# EAGLE design USB-C-UPDI (EAGLE 9.6.2)
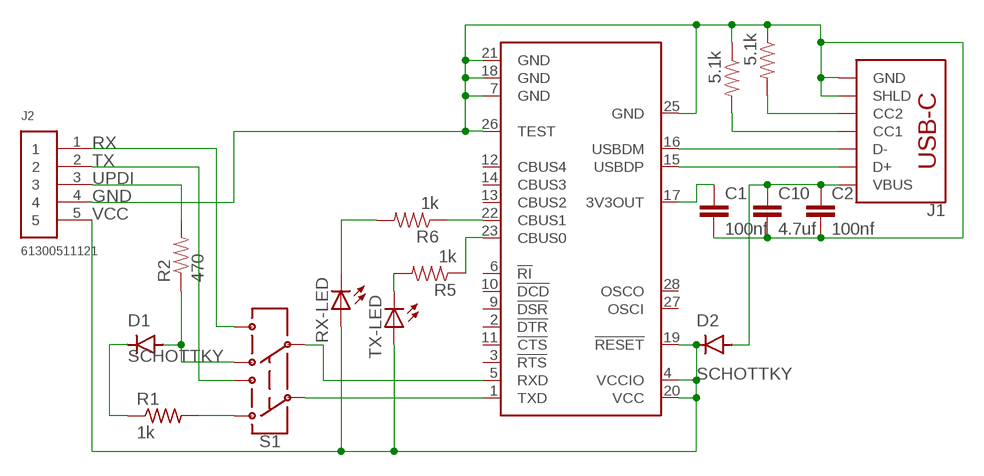
[diagram p0: schematic, sheet 1]

## Parts
C1  100nf  CAP1206  [1206]
C2  100nf  CAP1206  [1206]
C10  4.7uf  CAP1206  [1206]
D1  SCHOTTKY  DIODE_SCHOTTKY_CDBM1100-G  [MINI-SMA]
D2  SCHOTTKY  DIODE_SCHOTTKY_CDBM1100-G  [MINI-SMA]
IC1  FT232RL  [SSOP28]
J1  USB_C_4-LAYER_PADS  [USB-C-16P_4LAYER-PADS]
J2  61300511121  [61300511121]
R1  1k  R1206FAB  [R1206FAB]
R2  470  RESISTOR1206  [1206]
R5  1k  RESISTOR1206  [1206]
R6  1k  RESISTOR1206  [1206]
R9  5.1k  RESISTOR1206  [1206]
R10  5.1k  RESISTOR1206  [1206]
RX-LED  LED  [LED1206]
S1  SWITCH-DPDT-SMD-AYZ0202  [SWITCH_DPDT_SMD_AYZ0202]
TX-LED  LED  [LED1206]

## Nets
GND: C1.2 C2.2 C10.2 IC1.7(GND) IC1.18(GND) IC1.21(GND) IC1.25(GND) IC1.26(TEST) J1.GND J1.GND2(GND) J1.SHLD1(SHLD) J1.SHLD2(SHLD) J1.SHLD3(SHLD) J1.SHLD4(SHLD) J2.4 R9.1 R10.1
N$1: C1.1 IC1.17(3V3OUT)
N$2: IC1.16(USBDM) J1.A7(D-) J1.B7(D-)
N$3: D1.ANODE R2.1 S1.6
N$4: D1.KATHODE R1.1
N$5: IC1.15(USBDP) J1.A6(D+) J1.B6(D+)
N$7: IC1.5(RXD) S1.5
N$9: J1.A5(CC1) R9.2
N$10: IC1.1(TXD) S1.2
N$11: R1.2 S1.3
N$42: J1.B5(CC2) R10.2
N$43: IC1.22(CBUS1) R6.1
N$44: IC1.23(CBUS0) R5.1
N$45: R5.2 TX-LED.2(C)
N$46: R6.2 RX-LED.2(C)
N$49: C2.1 C10.1 D2.ANODE J1.VBUS1(VBUS) J1.VBUS2(VBUS)
RX: J2.1 S1.4
TX: J2.2 S1.1
UPDI: J2.3 R2.2
VCC: D2.KATHODE IC1.4(VCCIO) IC1.19(!RESET) IC1.20(VCC) J2.5 RX-LED.1(A) TX-LED.1(A)
Unconnected: IC1.2(!DTR) IC1.3(!RTS) IC1.6(!RI) IC1.9(!DSR) IC1.10(!DCD) IC1.11(!CTS) IC1.12(CBUS4) IC1.13(CBUS2) IC1.14(CBUS3) IC1.27(OSCI) IC1.28(OSCO)

## Library data of the parts
C1 C2 C10 = 01_SparkFun:CAP: Capacitor Standard 0603 ceramic capacitor, and 0.1" leaded capacitor.
D1 D2 = eagle_fab:DIODE_SCHOTTKY_CDBM1100-G: Diode schottky 100V 1A mini-SMA as found in the fablab inventory Reverse Voltage: 100 Volts Forward Current: 1.0 Amp Maximum forward voltage: 0.85 Volts Made by Zaerc.
IC1 = ftdichip:FT232R: Source: http://www.ftdichip.com/Documents/DataSheets/DS_FT232R_v104.pdf; MPN: FT232RL; OC_FARNELL: 1146032; OC_NEWARK: 91K9918
J1 = SparkFun-Connectors:USB_C: USB Type C 16Pin Connector Super Speed pins not available on the 16-pin purely SMD connector so this part is best for USB 2.0 implementations. D1 and D2 are tied together enabling D+/- no matter which way the cable is plugged into the connector. The two channel configuration pins (CC1/2) are exposed. These are normally connected to ground via 5.1k resistors but can be reconfigured for high current/high power applications. **4-LAYER BOARD WARNING!!** If designing 4-layer board, make sure to select the variant _4-LAYER-ISOLATED. The linked footprint (USB-C-16-4LAYER-ISOLATED) includes some very necessary cutout polygons in the inner layers (2 and 15). This prevents the PTH mounting shield legs on the USB connector from electrically connecting any other polygons on the inner layers (usually VCC and GND).; PROD_ID: CONN-14122
J2 = Headers:61300511121: CONN HEADER VERT 5POS 2.54MM Manufacturer's datasheet <https://katalog.we-online.de/em/datasheet/6130xx11121.pdf>; CREATED_BY: PCBLayout.com; DIGI_KEY_PART_NUMBER: 732-5318-ND; MANUFACTURER: Wurth Electronics Inc.; MPN: 61300511121
R1 = eagle_fab:R: Resistor (US Symbol) Variants with postfix FAB are widened to allow the routing of internal traces
R2 R5 R6 R9 R10 = 01_SparkFun:RESISTOR: Resistor Basic schematic elements and footprints for 0603, 1206, and PTH 1/10th watt (small) resistors.
RX-LED TX-LED = eagle_fab:LED: LED
S1 = SparkFun-Switches:SWITCH-DPDT: Double-Pole, Double-Throw (DPDT) Switch Double-pole, double-throw switches. Variant Overview PTH-GPI-152-3013 Used on SparkFun Geiger Counter <https://www.sparkfun.com/products/11345> SMD-AY0202 Surface Mount DPDT Switch <https://www.sparkfun.com/products/597> (COM-00597) Used on e.g. LilyPad Arduino USB - ATmega32U4 Board <https://www.sparkfun.com/products/12049>; PROD_ID: SWCH-08179; SF_SKU: COM-00597

## Net classes
0 default: width 0.457 mm

## Board
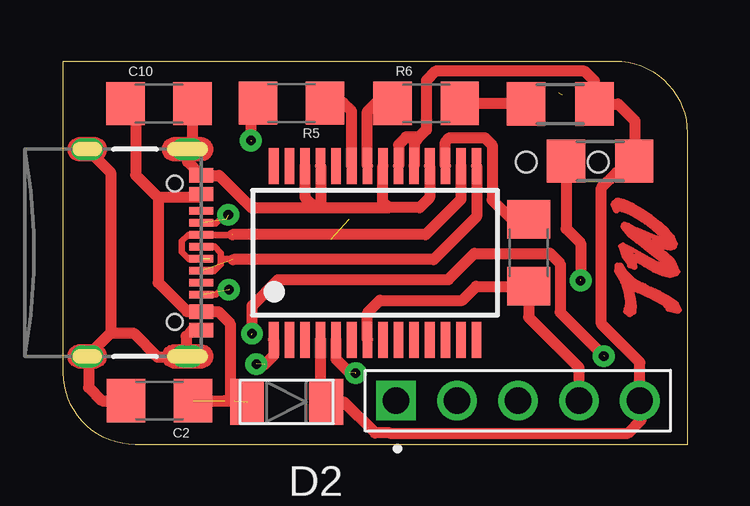
[diagram p1: board, top side]
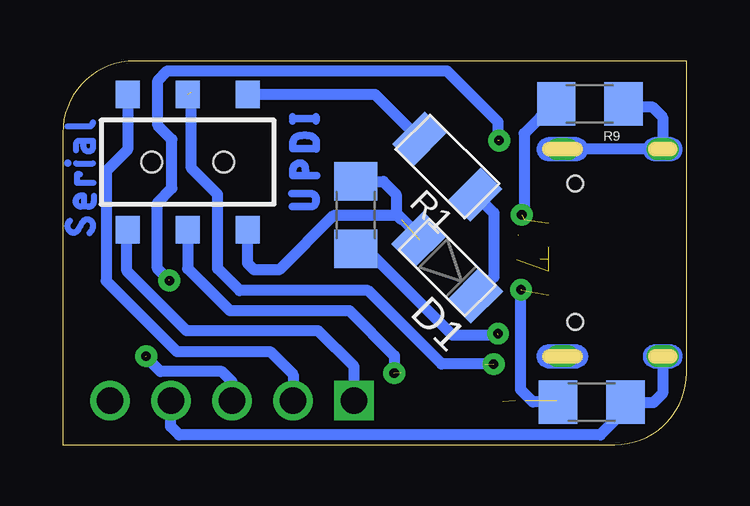
[diagram p2: board, bottom side, seen from below]

Size 26 x 16 mm. Coordinates in mm from the lower left corner, seen from the top.
Outline: 0,16 23,16 arc-90 26,13 26,0 3,0 arc-90 0,3 0,16
Copper layers (1*16): Top 0.035mm / dielectric 1.5mm / Bottom 0.035mm
Design rules "OthermillDRC_30_deg_v2": minimum track width 6mil, minimum drill 0.8mm, track to track 6mil, track to pad 6mil, pad to pad 6mil, via to via 6mil, smd to smd 0mil, copper to edge 0mil, drill to drill 6mil, minimum pad ring 10mil, minimum via ring 10mil, stop-mask expansion 1mil, vias tented up to drill 30mil, thermal gap 6mil

### Footprints (pad centres in the part's own frame; a part is rotated, then mirrored left to right if it is on the bottom)
1206 = smd 1.6 x 1.8: 1 -1.4,0; 2 1.4,0
MINI-SMA = smd 1.4 x 1.9: ANODE 1.65,0; KATHODE -1.65,0
SSOP28 = smd 0.4 x 1.5: 1 -4.225,-3.625; 2 -3.575,-3.625; 3 -2.925,-3.625; 4 -2.275,-3.625; 5 -1.625,-3.625; 6 -0.975,-3.625; 7 -0.325,-3.625; 8 0.325,-3.625; 9 0.975,-3.625; 10 1.625,-3.625; 11 2.275,-3.625; 12 2.925,-3.625; 13 3.575,-3.625; 14 4.225,-3.625; 15 4.225,3.625; 16 3.575,3.625; 17 2.925,3.625; 18 2.275,3.625; 19 1.625,3.625; 20 0.975,3.625; 21 0.325,3.625; 22 -0.325,3.625; 23 -0.975,3.625; 24 -1.625,3.625; 25 -2.275,3.625; 26 -2.925,3.625; 27 -3.575,3.625; 28 -4.225,3.625
USB-C-16P_4LAYER-PADS = smd 0.3 x 1: A5 -1.25,-0.34; A6 -0.25,-0.34; A7 0.25,-0.34; A8 1.25,-0.34; B5 1.75,-0.34; B6 0.75,-0.34; B7 -0.75,-0.34; B8 -1.75,-0.34 | smd 0.6 x 1: GND -3.225,-0.34; GND2 3.225,-0.34; VBUS1 -2.45,-0.34; VBUS2 2.45,-0.34 | drill 0.4 pad 0.6 long: SHLD1 -4.318,-0.915; SHLD2 4.318,-0.915; SHLD3 -4.318,-5.095; SHLD4 4.318,-5.095 | hole 0.65: -2.89,-1.445; 2.89,-1.445
61300511121 = drill 1.1 square: 1 -5.08,0 | drill 1.1: 2 -2.54,0; 3 0,0; 4 2.54,0; 5 5.08,0
R1206FAB = smd 1.27 x 1.905: 1 -1.651,0; 2 1.651,0
LED1206 = smd 1.6 x 1.803: 1 -1.422,0; 2 1.422,0
SWITCH_DPDT_SMD_AYZ0202 = smd 1 x 1.15: 1 -2.5,2.825; 2 0,2.825; 3 2.5,2.825; 4 -2.5,-2.825; 5 0,-2.825; 6 2.5,-2.825 | hole 0.85: 1.5,0; -1.5,0

### Placement (x,y rotation side)
C1  19.39,8 270 top
C2  4.01,1.84 180 top
C10  3.99,14.22 0 top
D1  9.98,7.38 135 bottom
D2  9.31,1.78 180 top
IC1  12.99,8 0 top
J1  6.09,8 270 top
J2  18.94,1.83 0 top
R1  9.97,11.6 135 bottom
R2  13.79,9.58 270 bottom
R5  9.51,14.24 180 top
R6  15.12,14.23 0 top
R9  4.04,14.21 180 bottom
R10  3.96,1.78 180 bottom
RX-LED  20.7,14.21 180 top
S1  20.8,11.78 0 bottom
TX-LED  22.37,11.83 180 top

### Tracks (layer width: path | path; a pad name or v marks a point on that pad's centre or on a via)
GND
  Top 0.457: J1.GND2 5.37,4.77 5.12,4.52 5.12,3.74 | 5.12,3.74 J1.SHLD2 5.41,3.45 | IC1.18 15.27,10.3 14.85,9.88 13.55,9.88 | IC1.21 13.32,10.11 13.55,9.88 | IC1.26 10.07,10.31 10.5,9.88 | 10.5,9.88 13.55,9.88 | IC1.25 10.72,10.09 10.5,9.88 | J1.SHLD3 1.97,11.35 1.97,4.65 | 1.97,4.65 J1.SHLD4 1.05,3.63 1.05,2.39 1.61,1.84 C2.2 | 5.4,14.24 C10.2 5.39,12.53 J1.SHLD1 5.18,11.8 J1.GND 6.49,11.22 7.84,9.88 10.5,9.88 | J2.4 21.48,3.22 19.39,5.31 C1.2 17.21,6.6 16.62,6.02 13.2,6.02 12.67,5.49 IC1.7 | 1.97,4.65 2.93,4.65 3.92,3.66 5.03,3.66 5.12,3.74
  Bottom 0.457: J1.SHLD4 1,2.14 1.38,1.75 2.53,1.75 R10.1 2.56,1.44 3.59,0.41 21.15,0.41 21.5,0.76 21.5,1.81 J2.4 | 2.64,14.59 R9.1 2.52,14.1 1.44,14.1 1,13.66 J1.SHLD3 J1.SHLD1
N$1
  Top 0.457: 19.36,9.37 C1.1 18.68,9.4 17.87,10.21 17.87,12.5 17.56,12.8 16.09,12.8 15.92,12.63 IC1.17
N$2  (2 unrouted)
  Top 0.279: 7.02,8.75 J1.B7 5.21,8.75 4.94,8.48 4.94,8.03 5.22,7.75 6.11,7.75
  Top 0.457: IC1.16 16.57,10.23 15.1,8.76 7.05,8.76
N$3  (1 unrouted)
  Bottom 0.457: R2.1 12.64,10.98 12.1,10.44 12.1,9.65 11.15,8.69 D1.ANODE | 11.9,9.4 12.05,9.55 14.72,9.55 16.98,7.29 18.02,7.29 18.29,7.56 S1.6
N$4
  Bottom 0.457: R1.1 8.04,9.67 8.04,6.99 D1.KATHODE
N$5  (2 unrouted)
  Top 0.457: IC1.15 17.22,9.51 15.43,7.72 7.07,7.72
N$6
  Bottom 0.32: 25.79,11.74 25.79,11.75
N$7  (via drill 0.4 pad 0.8)  (2 unrouted)
  Top 0.457: IC1.5 11.36,3.57 11.91,3.02
  Bottom 0.457: S1.5 20.79,7.34 19.04,5.59 14.06,5.59 12.18,3.71 12.18,3
  other vias: 12.18,2.98
N$9  (via drill 0.4 pad 0.8)  (2 unrouted)
  Bottom 0.457: R9.2 5.53,14.21 6.77,12.98 6.77,9.4
  other vias: 6.87,9.58
N$10  (via drill 0.4 pad 0.8)  (2 unrouted)
  Top 0.457: IC1.1 8.77,3.72 8.39,3.34
  Bottom 0.457: v8.04,3.36 10.21,3.36 13.27,6.43 18.63,6.43 19.55,7.34 19.55,10.44 20.64,11.53 20.64,14.68
N$11
  Bottom 0.457: R1.2 12.98,14.61 S1.3
N$13
  Top 0.279: 5.75,7.25 6.3,7.25 6.57,7.52 6.57,8 6.31,8.25 5.4,8.25
N$14
  Top 0.2: 24.25,6.29 24.36,6.23 24.74,6.04 25.12,5.83 25.11,5.78 25.2,5.65 25.63,5.56 25.67,5.62 25.55,5.88 25.21,6.11 24.85,6.3 24.48,6.48 24.25,6.59
N$15
  Top 0.2: 24.25,6.29 24,6.41 23.63,6.58 23.68,6.39 23.77,6.07 23.8,5.75 23.78,5.53 23.61,5.41 23.54,5.47 23.43,5.55 23.45,5.67 23.51,5.87 23.47,6.2 23.4,6.52 23.31,6.78 23.17,7.02 23.05,7.24 23.07,7.48 23.25,7.48 23.43,7.15 23.73,6.86 24.1,6.67 24.25,6.59
N$16
  Top 0.2: 24.46,7.69 24.77,7.53 25.23,7.39 25.02,7.61 24.25,8.22
N$17
  Top 0.2: 24.46,7.69 24.37,7.74 23.98,7.96 23.65,8.15 23.31,8.33 23.22,8.28 23.38,7.83 23.5,7.67 23.59,7.47 23.83,7.39 23.8,7.71 23.75,7.78 23.99,7.65 24.22,7.5 24.46,7.37
N$18
  Top 0.2: 24.46,9.13 24.6,9.03 24.93,8.75 25.05,8.54 24.65,8.63
N$19
  Top 0.2: 24.46,9.13 24.26,9.28 23.9,9.51 23.53,9.72 23.15,9.85 23.09,9.82 23.07,9.76 23.03,9.75 22.9,10.03 23.07,10.19 23.34,10.14 23.75,9.96 24.13,9.73 24.46,9.5
N$20
  Top 0.2: 24.46,7.37 24.59,7.3 24.97,7.13 25.27,7.06 25.56,7.13 25.61,7.21 25.41,7.64 25.06,7.97 24.67,8.27 24.6,8.36 24.95,8.25 25.31,8.2 25.46,8.24 25.5,8.37 25.38,8.66 25.17,8.9 24.85,9.21 24.5,9.48 24.46,9.5
N$21
  Top 0.2: 24.62,8.64 24.37,8.73 23.9,8.95 23.54,9.14 23.35,9.2 23.32,9.08 23.58,8.75 23.91,8.49 24.23,8.25
N$22
  Top 0.2: 23.61,5.62 23.65,5.77 23.63,6.02 23.58,6.28 23.53,6.57 23.42,6.91 23.34,7.07 23.2,7.32 23.71,6.67 24.06,6.54 24.43,6.38 24.8,6.19 25.09,6.03 25.32,5.87 25.29,5.82 25.42,5.77 25.49,5.72 25.44,5.89
N$23
  Top 0.2: 23.69,7.56 23.64,7.71 23.54,7.84 23.43,8.13 23.63,8.03 23.7,7.89 23.84,7.86 24.14,7.73 24.43,7.53 24.84,7.34 25.25,7.23 25.44,7.27 25.38,7.4 25.21,7.65 24.98,7.88 24.8,8.01 24.5,8.26 24.22,8.45 23.99,8.62 23.81,8.75 23.66,8.91 23.53,9.02 24.01,8.77 24.16,8.68 24.39,8.54 24.54,8.43 24.58,8.49 24.8,8.44 25.07,8.4 25.22,8.39 25.35,8.37 25.21,8.48 25.26,8.55 25.19,8.6 25.1,8.78 25.01,8.89 24.74,9.14 24.52,9.28 24.12,9.56 23.73,9.78 23.5,9.91 23.31,9.98 23.16,10.03 23.07,9.98
N$24
  Top 0.279: 6.59,7.73 7.14,7.73
N$27
  Top 0.279: 5.8,9.23 6.35,9.23 6.62,9.5
N$28
  Top 0.279: 5.63,6.26 6.38,6.26 6.57,6.45
N$33
  Bottom 0.32: 16.43,9.93 15.67,9.93 arc-102 15.45,10.2
N$34
  Bottom 0.32: 16.45,10.47 15.66,10.47 arc106 15.45,10.19
N$35
  Bottom 0.32: 15.42,11.22 16.41,11.22 | 16.41,11.22 16.42,11.22 | 16.41,11.22 16.41,11.47 arc59 16.28,11.7 arc41 16.07,11.74 arc71 15.9,11.57 arc15 15.89,11.26
N$36
  Bottom 0.32: 16.42,12.36 16.42,12.34 15.45,12.34
N$37
  Bottom 0.32: 16.41,12.35 16.41,12.6 arc39 16.35,12.77 arc38 16.19,12.87
N$38
  Bottom 0.32: 15.43,12.33 15.43,12.57 arc-39 15.5,12.77 arc-35 15.65,12.87 arc-32 16.2,12.87
N$39
  Bottom 0.32: 16.42,13.6 15.44,13.6 15.44,13.59
N$40
  Bottom 0.3: 15.44,13.7 15.44,13.49
N$41
  Bottom 0.3: 16.42,13.69 16.42,13.48
N$42  (via drill 0.4 pad 0.8)  (2 unrouted)
  Bottom 0.457: R10.2 6.41,1.78 6.92,2.29 6.92,6.46
  other vias: 6.9,6.46
N$43
  Top 0.457: IC1.22 12.67,13.9 13.05,14.28 13.67,14.28 R6.1
N$44
  Top 0.457: IC1.23 12.02,13.9 11.67,14.25 R5.1
N$45  (via drill 0.4 pad 0.8)  (3 unrouted)
  Top 0.457: 21.13,11.65 TX-LED.2 20.95,9.01 21.55,8.41 21.55,6.89 | 8.11,14.06 R5.2 7.81,13.95 v7.81,12.68
  Bottom 0.457: v21.56,6.84 22.06,7.34 22.06,10.08 21.45,10.69 21.45,12.72 22.03,13.31 22.03,15.19 21.64,15.59 9.99,15.59 7.86,13.46 7.86,12.68
N$46
  Top 0.457: R6.2 19.26,14.23 RX-LED.2
N$47
  Bottom 0.25: 25.45,11.73 24.74,11.73
N$48
  Bottom 0.25: 25.28,11.28 25.41,11.28 25.41,10.93 24.72,10.93
N$49  (2 unrouted)
  Top 0.457: D2.ANODE 7.68,1.81 7.68,1.83 7.68,1.84 | C10.1 3.02,13.79 3.02,11.24 3.95,10.31 | 3.95,10.31 5.61,10.31 J1.VBUS1 | C2.1 6.95,1.84 6.95,5.05 6.45,5.55 J1.VBUS2 5.16,5.55 3.95,6.75 3.95,10.31 | 6.72,1.84 7.15,1.84
N$50
  Bottom 0.25: 25.44,12.27 25.44,12.53 arc100 25.26,12.68 24.74,12.68 | 24.74,12.68 24.73,12.68 | 24.74,12.68 24.74,12.4 arc90 24.91,12.23 arc85 25.13,12.43 arc11 25.13,12.63
N$51
  Bottom 0.25: 25.79,13.28 24.89,13.28 arc-97 24.74,13.45
N$123
  Bottom 0.25: 24.7,10.39 24.71,10.13 arc93 24.94,9.93
N$124
  Bottom 0.25: 24.93,9.93 25.26,9.93
N$125
  Bottom 0.25: 25.11,9.94 25.11,10.39 25.23,10.39 arc-85 25.46,10.18 arc-74 25.31,9.94
N$126
  Bottom 0.25: 24.88,8.81 24.8,8.92 arc-54 24.75,9.24 arc-66 24.95,9.4 arc-50 25.12,9.34 arc-21 25.26,9.14 arc9 25.37,8.94 arc85 25.64,8.87 arc42 25.78,9.03 arc69 25.7,9.34
RX
  Bottom 0.457: J2.1 13.86,3.26 15.35,4.75 20.84,4.75 23.33,7.24 23.33,8.92 S1.4
TX
  Bottom 0.457: S1.1 23.29,12.3 24.19,11.4 24.19,6.83 21.25,3.89 17.36,3.89 16.4,2.92 J2.2
UPDI  (via drill 0.4 pad 0.8)  (3 unrouted)
  Top 0.457: v7.87,4.63 7.87,5.79 8.95,6.88 16.04,6.88 17.13,7.97 20.28,7.97 20.71,7.55 20.71,5.52 22.52,3.71
  Bottom 0.457: J2.3 18.94,2.62 19.37,3.05 21.93,3.05 22.57,3.68 | R2.2 13.37,8.18 9.77,4.57 7.86,4.57
  other vias: 22.52,3.69
VCC
  Top 0.457: 23.79,11.35 23.79,11.3 23.81,11.33 23.81,13.51 23.11,14.21 RX-LED.1 22.13,15.17 21.73,15.57 15.51,15.57 15.13,15.19 15.13,13.13 14.82,12.83 | 23.79,11.35 TX-LED.1 | 14.82,12.83 14.72,12.72 14.74,12.72 14.62,12.6 IC1.19 | 14.82,12.83 14.29,12.83 13.97,12.51 IC1.20 | IC1.4 10.72,2.02 D2.KATHODE 11.69,1.78 12.99,0.49 13.6,0.49 13.6,0.48 23.53,0.48 24.07,1.02 24.07,1.78 J2.5 24.02,3.42 22.42,5.03 22.42,10.72 23.05,11.35 23.79,11.35